# EAGLE schematic V3s_LX9_AD9957_gps (EAGLE 7.2.0)
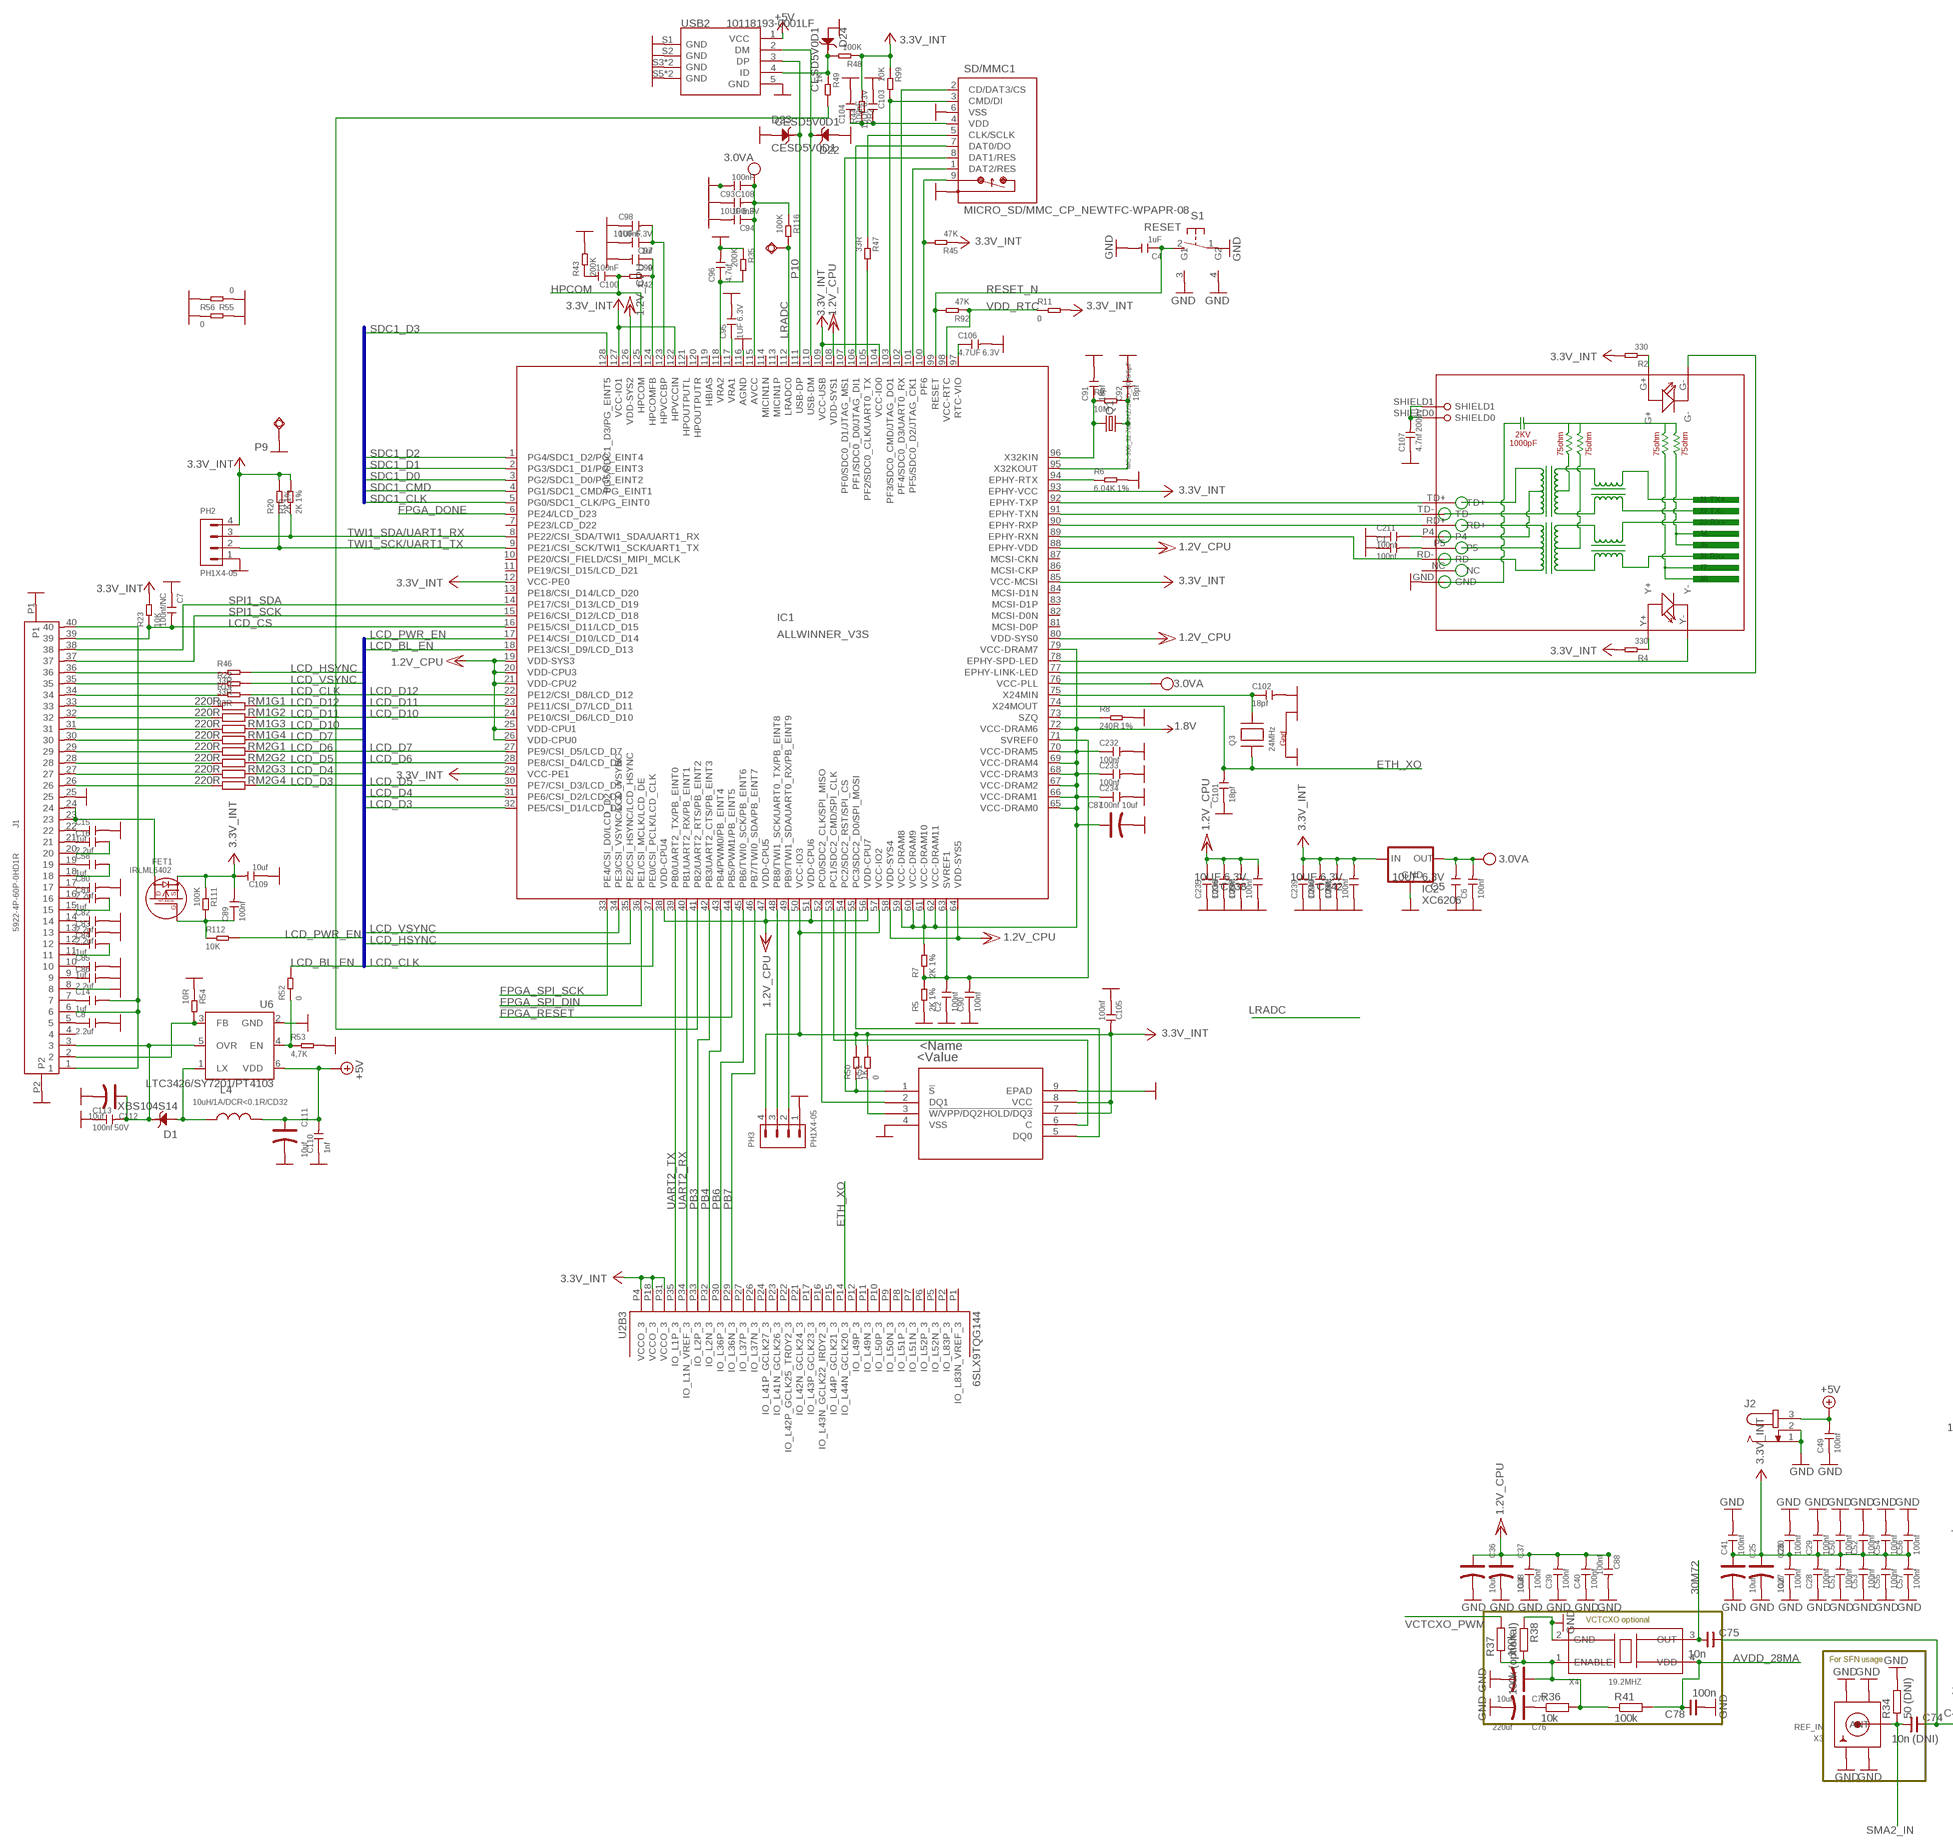
[diagram p0: schematic, sheet 1, part 1 of 3]
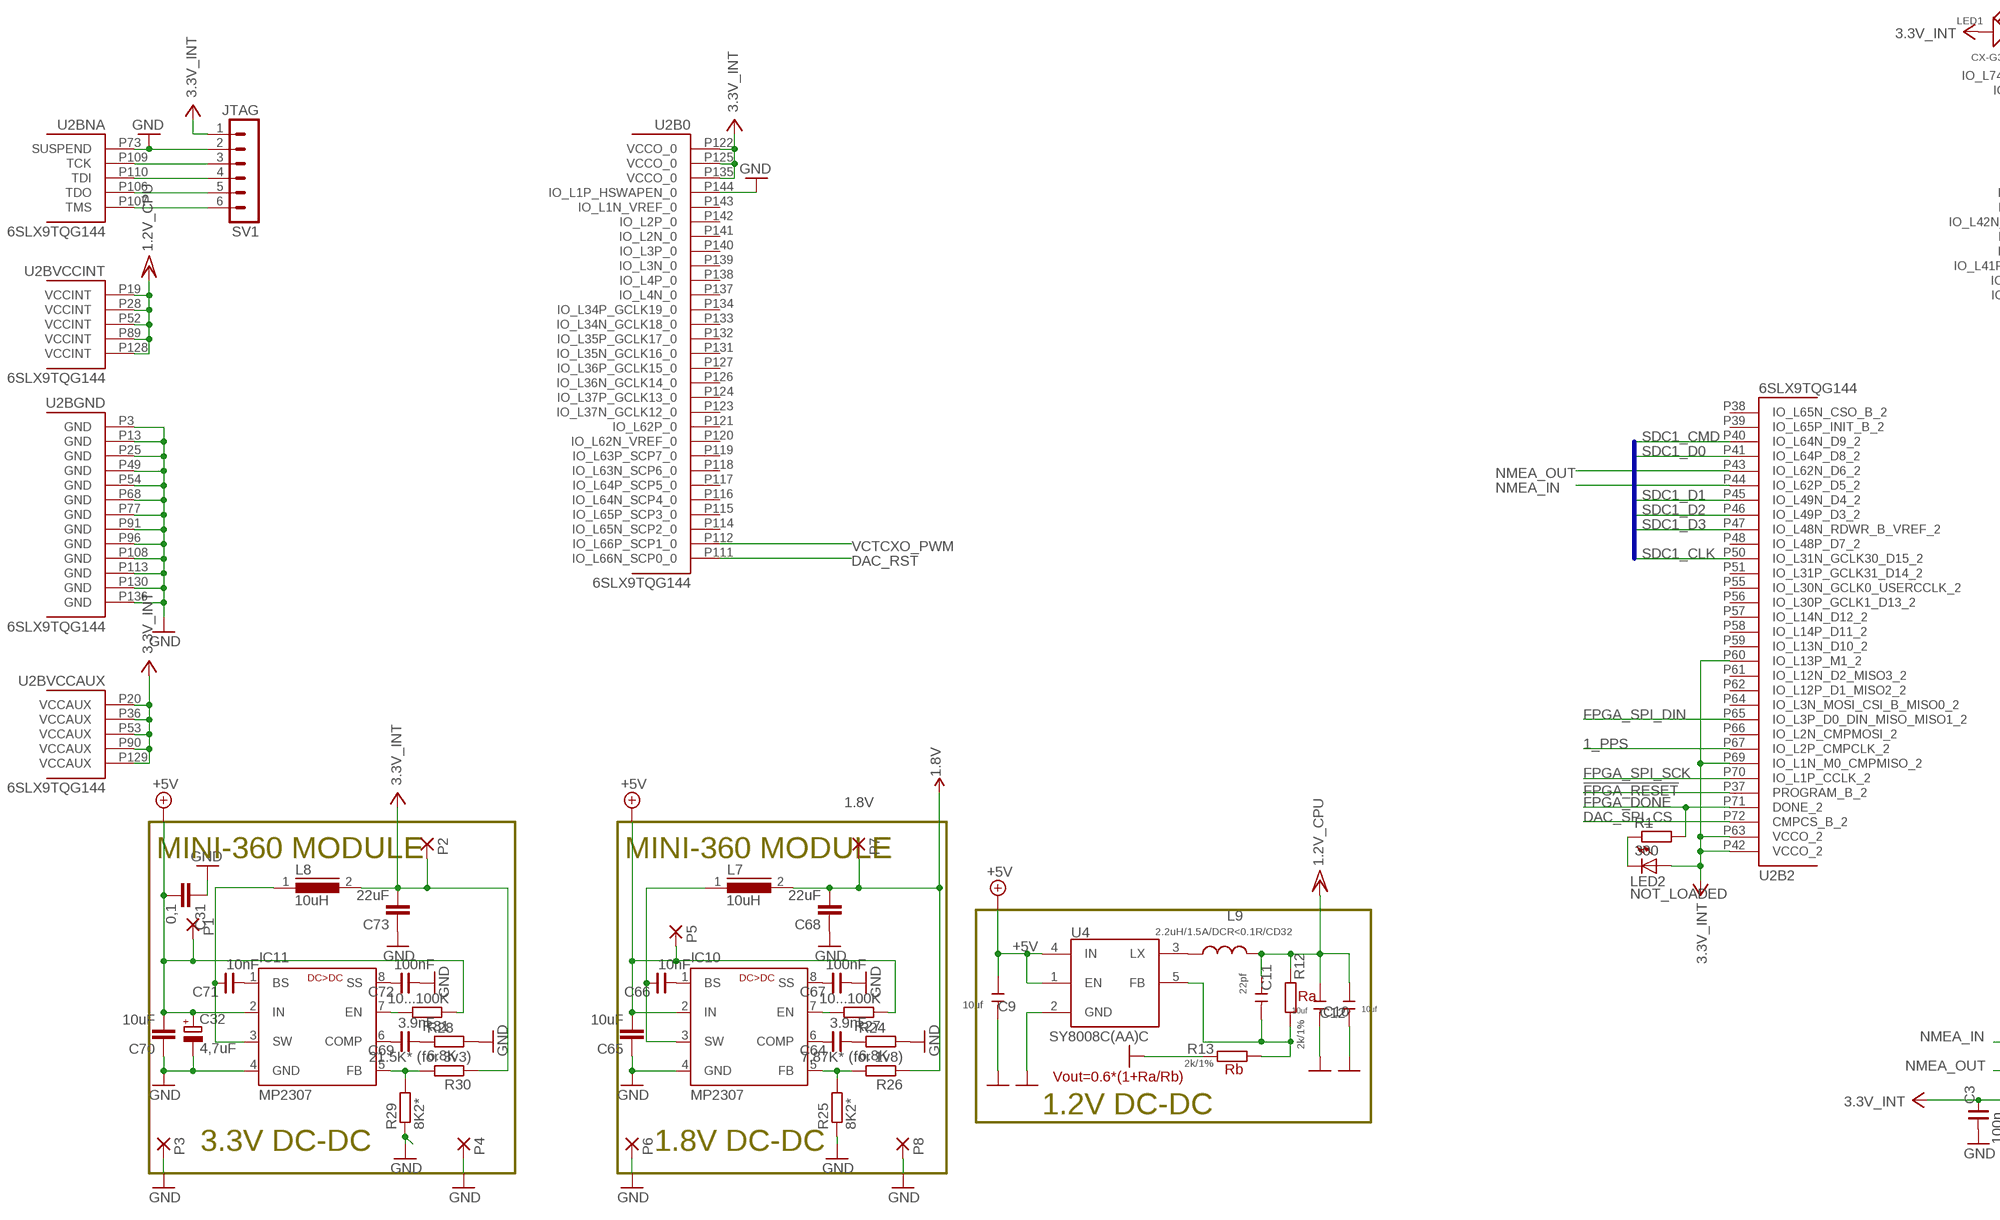
[diagram p1: schematic, sheet 1, part 2 of 3]
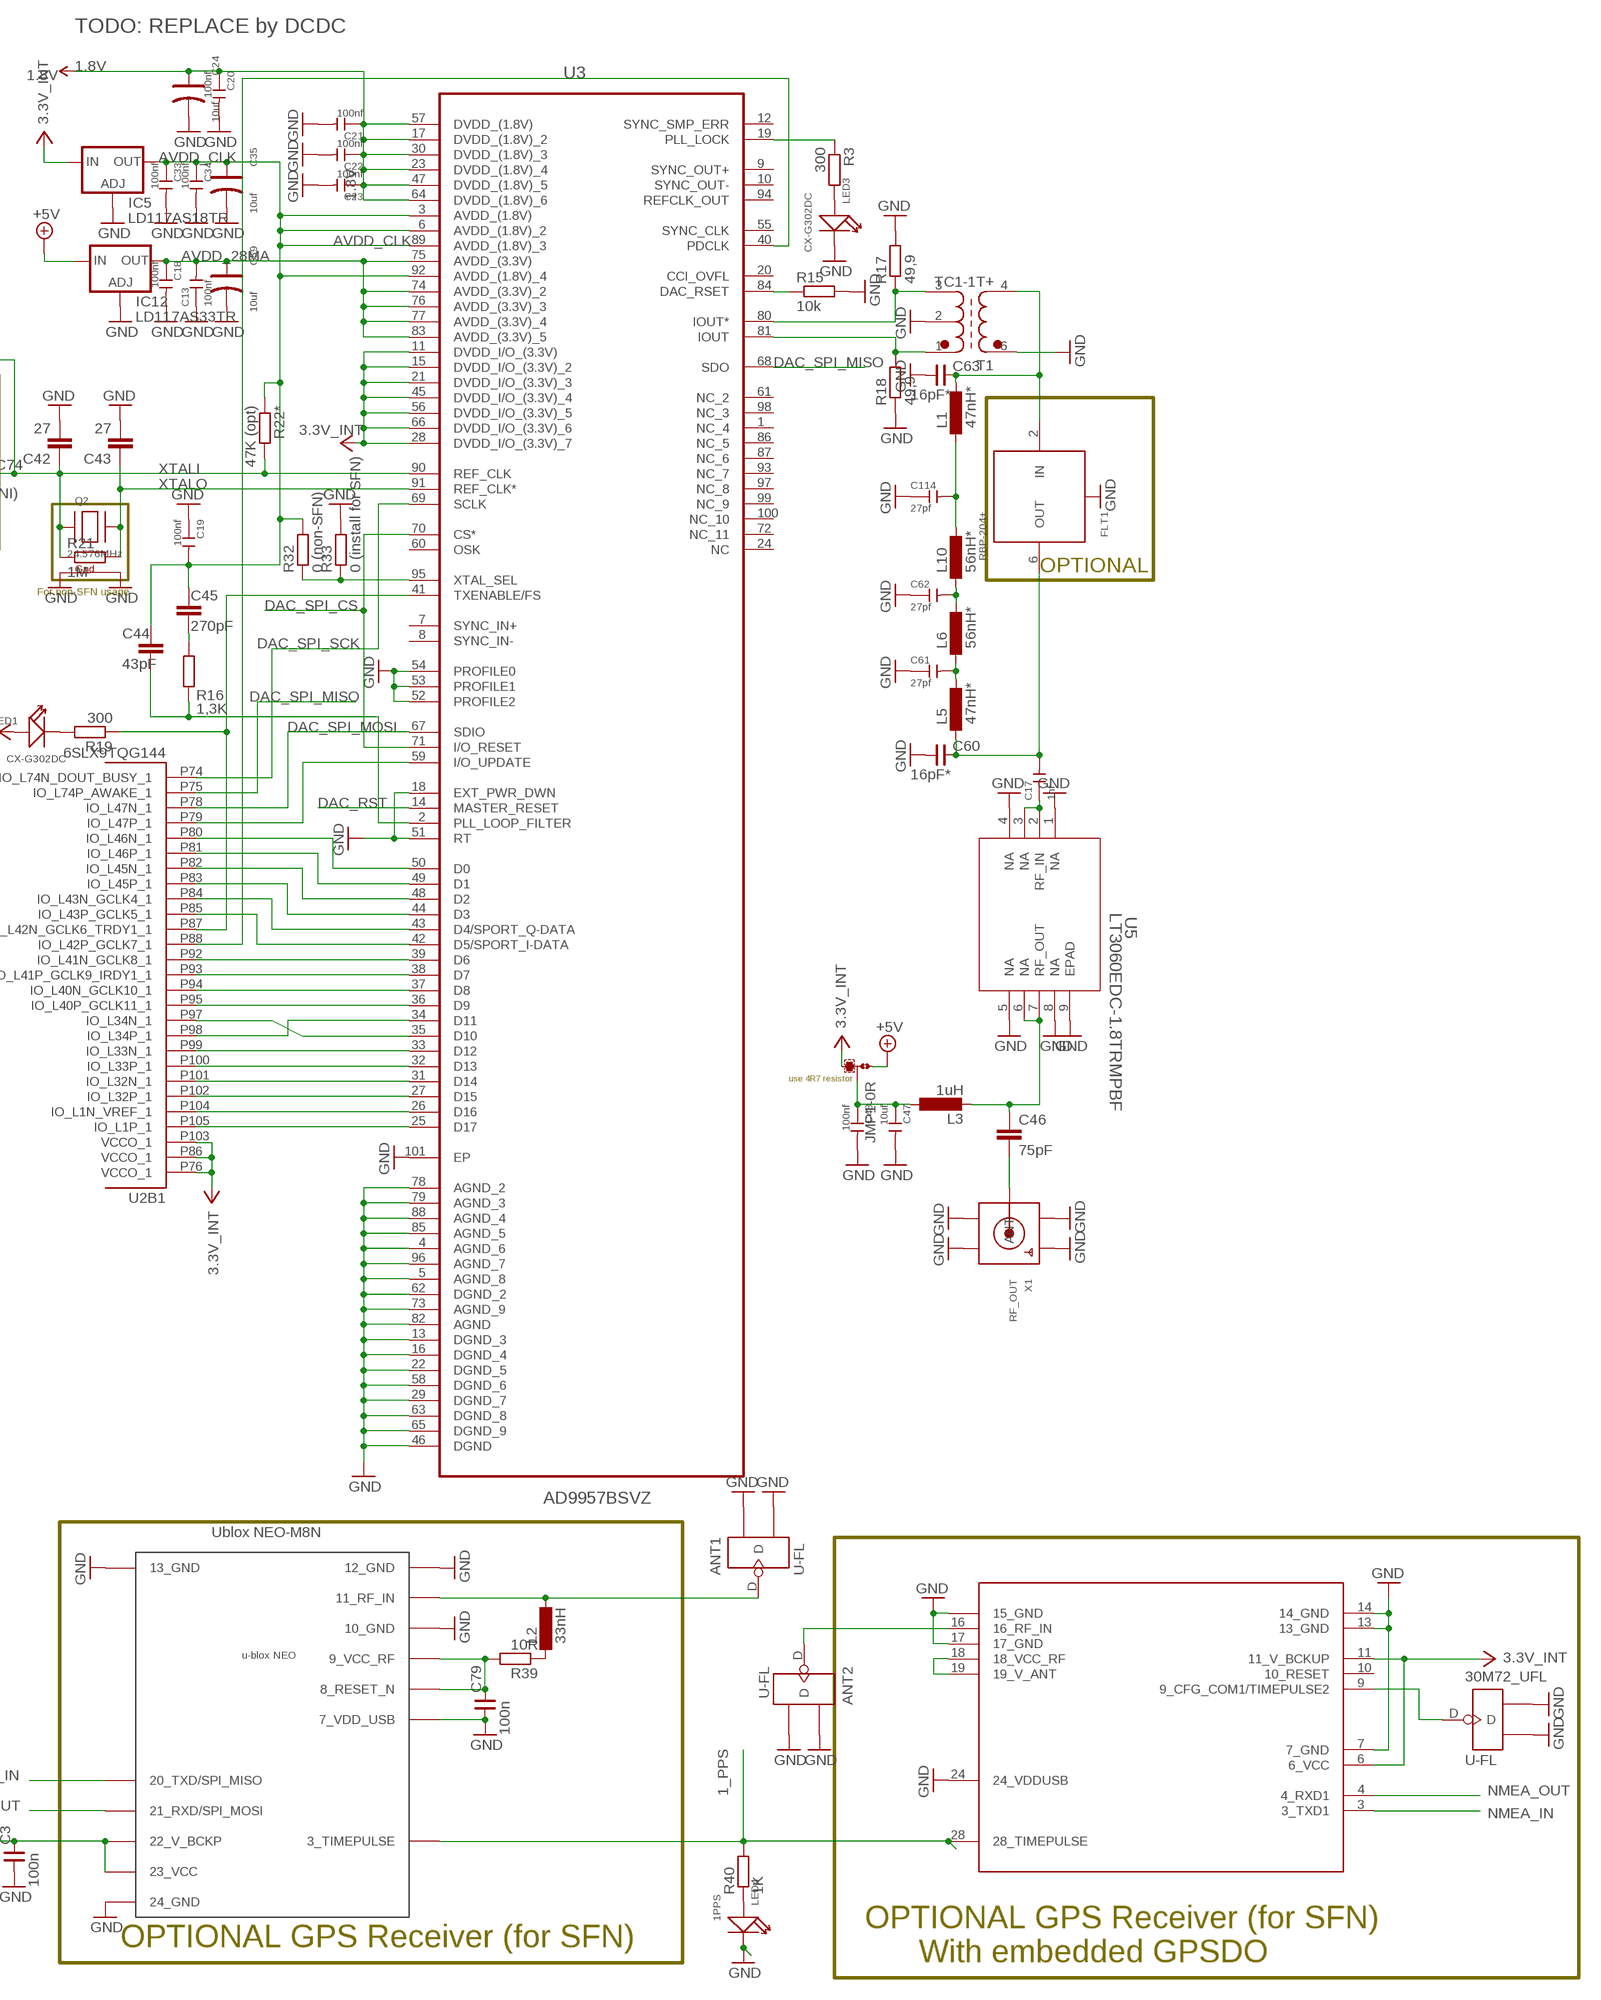
[diagram p2: schematic, sheet 1, part 3 of 3]

## Parts
30M72_UFL  U-FL  ANTENNA-CONN-U-FL(3P)  [U-FL3P-SMD-2.6X2.6X1.0MM]
ANT1  U-FL  ANTENNA-CONN-U-FL(3P)  [U-FL3P-SMD-2.6X2.6X1.0MM]
ANT2  U-FL  ANTENNA-CONN-U-FL(3P)  [U-FL3P-SMD-2.6X2.6X1.0MM]
C1  100nf  CERAMIC-100NF-50V-10%-X7R(0603)  [C0603]
C2  100nf  CERAMIC-100NF-50V-10%-X7R(0603)  [C0603]
C3  100n  CNP-0603  [0603]
C4  1uF  CERAMIC-100NF-50V-10%-X7R(0603)  [C0603]
C5  10UF 6.3V  CERAMIC-10UF-6.3V-20%-X5R(0603)  [C0603]
C6  100nf  CERAMIC-100NF-50V-10%-X7R(0603)  [C0603]
C7  100nf/NC  CERAMIC-100NF-50V-10%-X7R(0603)  [C0603]
C8  2.2uf  CERAMIC-2.2UF-10V-10%-X7R(0603)  [C0603]
C9  10uf  CERAMIC-10UF-10V-10%-X5R(0603)  [C0603]
C10  10uf  CERAMIC-10UF-10V-10%-X5R(0603)  [C0603]
C11  22pf  CERAMIC-22PF-50V-5%-NPO(0603)  [C0603]
C12  10uf  CERAMIC-10UF-10V-10%-X5R(0603)  [C0603]
C13  100nf  CERAMIC-100NF-50V-10%-X7R(0805)  [C0805]
C14  1uf  CERAMIC-1UF-25V-10%-X7R(0603)  [C0603]
C15  1uf  CERAMIC-1UF-25V-10%-X7R(0603)  [C0603]
C16  2.2uf  CERAMIC-2.2UF-10V-10%-X7R(0603)  [C0603]
C17  1nf  CERAMIC-1NF-50V-10%-X7R(0603)  [C0603]
C18  100nf  CERAMIC-100NF-50V-10%-X7R(0805)  [C0805]
C19  100nf  CERAMIC-100NF-50V-10%-X7R(0805)  [C0805]
C20  100nf  CERAMIC-100NF-50V-10%-X7R(0805)  [C0805]
C21  100nf  CERAMIC-100NF-50V-10%-X7R(0805)  [C0805]
C22  100nf  CERAMIC-100NF-50V-10%-X7R(0805)  [C0805]
C23  100nf  CERAMIC-100NF-50V-10%-X7R(0603)  [C0603]
C24  10uf  TANTALUM-SMD-10UF-10V-10%(AVX-A)  [AVX-A]
C25  10uf  TANTALUM-SMD-10UF-10V-10%(AVX-A)  [AVX-A]
C26  10uf  TANTALUM-SMD-10UF-10V-10%(AVX-A)  [AVX-A]
C27  100nf  CERAMIC-100NF-50V-10%-X7R(0805)  [C0805]
C28  100nf  CERAMIC-100NF-50V-10%-X7R(0805)  [C0805]
C29  100nf  CERAMIC-100NF-50V-10%-X7R(0805)  [C0805]
C30  100nf  CERAMIC-100NF-50V-10%-X7R(0603)  [C0603]
C31  0,1  C-EUC0805  [C0805]
C32  4,7uF  CPOL-EUA/3216-18R  [A/3216-18R]
C33  100nf  CERAMIC-100NF-50V-10%-X7R(0805)  [C0805]
C34  100nf  CERAMIC-100NF-50V-10%-X7R(0805)  [C0805]
C35  10uf  TANTALUM-SMD-10UF-10V-10%(AVX-A)  [AVX-A]
C36  10uf  TANTALUM-SMD-10UF-10V-10%(AVX-A)  [AVX-A]
C37  10uf  TANTALUM-SMD-10UF-10V-10%(AVX-A)  [AVX-A]
C38  100nf  CERAMIC-100NF-50V-10%-X7R(0603)  [C0603]
C39  100nf  CERAMIC-100NF-50V-10%-X7R(0603)  [C0603]
C40  100nf  CERAMIC-100NF-50V-10%-X7R(0603)  [C0603]
C41  100nf  CERAMIC-100NF-50V-10%-X7R(0805)  [C0805]
C42  27  C-EUC0805  [C0805]
C43  27  C-EUC0805  [C0805]
C44  43pF  C-EUC0805  [C0805]
C45  270pF  C-EUC0805  [C0805]
C46  75pF  C-EUC0805  [C0805]
C47  10uf  CERAMIC-10UF-25V-10%-X5R(0805)  [C0805]
C48  100nf  CERAMIC-100NF-50V-10%-X7R(0805)  [C0805]
C49  100nf  CERAMIC-100NF-50V-10%-X7R(0805)  [C0805]
C50  100nf  CERAMIC-100NF-50V-10%-X7R(0603)  [C0603]
C51  100nf  CERAMIC-100NF-50V-10%-X7R(0805)  [C0805]
C52  100nf  CERAMIC-100NF-50V-10%-X7R(0603)  [C0603]
C53  100nf  CERAMIC-100NF-50V-10%-X7R(0603)  [C0603]
C54  100nf  CERAMIC-100NF-50V-10%-X7R(0805)  [C0805]
C55  100nf  CERAMIC-100NF-50V-10%-X7R(0603)  [C0603]
C56  100nf  CERAMIC-100NF-50V-10%-X7R(0603)  [C0603]
C57  100nf  CERAMIC-100NF-50V-10%-X7R(0805)  [C0805]
C58  1uf  CERAMIC-1UF-25V-10%-X7R(0603)  [C0603]
C59  10uf  TANTALUM-SMD-10UF-10V-10%(AVX-A)  [AVX-A]
C60  16pF*  CNP-0603  [0603]
C61  27pf  CERAMIC-27PF-50V-5%-NPO(0603)  [C0603]
C62  27pf  CERAMIC-27PF-50V-5%-NPO(0603)  [C0603]
C63  16pF*  CNP-0603  [0603]
C64  3.9nF  CNP-0603  [0603]
C65  10uF  C-EUC1206  [C1206]
C66  10nF  CNP-0603  [0603]
C67  100nF  CNP-0603  [0603]
C68  22uF  C-EUC1206  [C1206]
C69  3.9nF  CNP-0603  [0603]
C70  10uF  C-EUC1206  [C1206]
C71  10nF  CNP-0603  [0603]
C72  100nF  CNP-0603  [0603]
C73  22uF  C-EUC1206  [C1206]
C74  10n (DNI)  CNP-0603  [0603]
C75  10n  CNP-0603  [0603]
C76  220uf  TANTALUM-SMD-470UF-6.3V(AVX-D)  [AVX-D]
C77  10uf  TANTALUM-SMD-10UF-10V-10%(AVX-A)  [AVX-A]
C78  100n  CNP-0603  [0603]
C79  100n  CNP-0603  [0603]
C80  2.2uf  CERAMIC-2.2UF-10V-10%-X7R(0603)  [C0603]
C81  1uf  CERAMIC-1UF-25V-10%-X7R(0603)  [C0603]
C82  2.2uf  CERAMIC-2.2UF-10V-10%-X7R(0603)  [C0603]
C83  2.2uf  CERAMIC-2.2UF-10V-10%-X7R(0603)  [C0603]
C84  1uf  CERAMIC-1UF-25V-10%-X7R(0603)  [C0603]
C85  1uf  CERAMIC-1UF-25V-10%-X7R(0603)  [C0603]
C86  2.2uf  CERAMIC-2.2UF-10V-10%-X7R(0603)  [C0603]
C87  10uf  TANTALUM-SMD-10UF-10V-10%(AVX-A)  [AVX-A]
C88  100nf  CERAMIC-100NF-50V-10%-X7R(0603)  [C0603]
C89  100nf  CERAMIC-100NF-50V-10%-X7R(0603)  [C0603]
C90  100nf  CERAMIC-100NF-50V-10%-X7R(0603)  [C0603]
C91  18pf  CERAMIC-100NF-50V-10%-X7R(0603)  [C0603]
C92  18pf  CERAMIC-100NF-50V-10%-X7R(0603)  [C0603]
C93  10UF 6.3V  CERAMIC-10UF-6.3V-20%-X5R(0603)  [C0603]
C94  100nF  CERAMIC-100NF-50V-10%-X7R(0603)  [C0603]
C95  1UF 6.3V  CERAMIC-10UF-6.3V-20%-X5R(0603)  [C0603]
C96  4.7uf  CERAMIC-4.7UF-10V-10%-X5R(0603)  [C0603]
C97  10UF 6.3V  CERAMIC-10UF-6.3V-20%-X5R(0603)  [C0603]
C98  100nF  CERAMIC-100NF-50V-10%-X7R(0603)  [C0603]
C99  1uf  CERAMIC-1UF-25V-10%-X7R(0603)  [C0603]
C100  100nF  CERAMIC-100NF-50V-10%-X7R(0603)  [C0603]
C101  18pf  CERAMIC-100NF-50V-10%-X7R(0603)  [C0603]
C102  18pf  CERAMIC-100NF-50V-10%-X7R(0603)  [C0603]
C103  10UF 6.3V  CERAMIC-10UF-6.3V-20%-X5R(0603)  [C0603]
C104  100nF  CERAMIC-100NF-50V-10%-X7R(0603)  [C0603]
C105  100nf  CERAMIC-100NF-50V-10%-X7R(0603)  [C0603]
C106  4.7UF 6.3V  CERAMIC-10UF-6.3V-20%-X5R(0603)  [C0603]
C107  4.7nf 2000V  CERAMIC-4.7UF-50V-10%-X5R(1206)  [C1206]
C108  100nF  CERAMIC-100NF-50V-10%-X7R(0603)  [C0603]
C109  10uf  CERAMIC-10UF-10V-(-20%～+80%)-Y5V(0805)  [C0805]
C110  1nf  CERAMIC-100NF-50V-10%-X7R(0603)  [C0603]
C111  10uf  TANTALUM-SMD-10UF-16V-10%(AVX-A)  [AVX-A]
C112  10uf  TANTALUM-SMD-10UF-10V-10%(AVX-A)  [AVX-A]
C113  100nf 50V  CERAMIC-100NF-50V-10%-X7R(0603)  [C0603]
C114  27pf  CERAMIC-27PF-50V-5%-NPO(0603)  [C0603]
C211  100nf  CERAMIC-100NF-50V-10%-X7R(0603)  [C0603]
C232  100nf  CERAMIC-100NF-50V-10%-X7R(0603)  [C0603]
C233  100nf  CERAMIC-100NF-50V-10%-X7R(0603)  [C0603]
C234  100nf  CERAMIC-100NF-50V-10%-X7R(0603)  [C0603]
C235  100nf  CERAMIC-100NF-50V-10%-X7R(0603)  [C0603]
C236  100nf  CERAMIC-100NF-50V-10%-X7R(0603)  [C0603]
C237  100nf  CERAMIC-100NF-50V-10%-X7R(0603)  [C0603]
C238  10UF 6.3V  CERAMIC-10UF-6.3V-20%-X5R(0603)  [C0603]
C239  100nf  CERAMIC-100NF-50V-10%-X7R(0603)  [C0603]
C240  100nf  CERAMIC-100NF-50V-10%-X7R(0603)  [C0603]
C241  100nf  CERAMIC-100NF-50V-10%-X7R(0603)  [C0603]
C242  10UF 6.3V  CERAMIC-10UF-6.3V-20%-X5R(0603)  [C0603]
D1  XBS104S14  SMD-DIODE-ESD-6.2V-250MW(SOD-123)  [SOD-123]
D22  CESD5V0D1  SMD-DIODE-ESD-6.2V-250MW(SOD-123)  [SOD-123]
D23  CESD5V0D1  SMD-DIODE-ESD-6.2V-250MW(SOD-123)  [SOD-123]
D24  CESD5V0D1  SMD-DIODE-ESD-6.2V-250MW(SOD-123)  [SOD-123]
FET1  IRLML6402  P-MOS+DIODIRLML6402  [SOT23]
FLT1  RBP-204+  RBP  [GP731]
IC1  ALLWINNER_V3S  [ELQFP128]
IC2  XC6206  XC63FPM  [SOT23]
IC5  LD117AS18TR  [SOT223]
IC10  MP2307  [SO8]
IC11  MP2307  [SO8]
IC12  LD117AS33TR  LD117AS18TR  [SOT223]
J1  5922-4P-60P-0HD1R  SMD-FPC-CONN(40P-0.5)  [FPCE40-SMD-0.5-90D]
J2  JACK-PLUG0  [SPC4077]
JMP1  0R-JUMPA  [A0R-JMP]
L1  47nH*  INDUCTOR_0603  [INDC1608X95N]
L2  33nH  INDUCTOR_0603  [INDC1608X95N]
L3  1uH  L-EUL3216C  [L3216C]
L4  10uH/1A/DCR<0.1R/CD32  L-CD32  [CD32]
L5  47nH*  INDUCTOR_0603  [INDC1608X95N]
L6  56nH*  INDUCTOR_0603  [INDC1608X95N]
L7  10uH  DR74  [DR74]
L8  10uH  DR74  [DR74]
L9  2.2uH/1.5A/DCR<0.1R/CD32  L-CD32  [CD32]
L10  56nH*  INDUCTOR_0603  [INDC1608X95N]
LED1  CX-G302DC  DIP-LED-GREEN-GREEN(2P-D3MM)  [LED2-2.54-D3.0MM]
LED2  NOT_LOADED  LEDCHIPLED_1206  [CHIPLED_1206]
LED3  CX-G302DC  DIP-LED-GREEN-GREEN(2P-D3MM)  [LED2-2.54-D3.0MM]
LED4  1PPS  DIP-LED-YELLOW-YELLOW-Y304DC(2P-D3MM)  [LED2-2.54-D3.0MM]
P1  1,6/0,8  [1,6/0,8]
P2  1,6/0,8  [1,6/0,8]
P3  1,6/0,8  [1,6/0,8]
P4  1,6/0,8  [1,6/0,8]
P5  1,6/0,8  [1,6/0,8]
P6  1,6/0,8  [1,6/0,8]
P7  1,6/0,8  [1,6/0,8]
P8  1,6/0,8  [1,6/0,8]
P9  TESTPADTESTPAD30/30  [TESTPAD_30-ROUND]
P10  TESTPADTESTPAD30/30  [TESTPAD_30-ROUND]
PH2  PH1X4-05  [PH005-1-4]
PH3  PH1X4-05  [PH005-1-4]
Q1  MC-306_32.768KHZ/SMD_8038/6pF  HC49/S_32768HZ/6PF  [MC-306]
Q2  24.576MHz  XTAL-4-3225  [NX3225]
Q3  24MHz  XTAL-4-3225  [NX3225]
R1  300  R-EU_M0805  [M0805]
R2  330  SMD-RES-6.8K-1%-1/10W(0603)  [R0603]
R3  300  R-EU_M0805  [M0805]
R4  330  SMD-RES-6.8K-1%-1/10W(0603)  [R0603]
R5  2K 1%  SMD-RES-6.8K-1%-1/10W(0603)  [R0603]
R6  6.04K 1%  SMD-RES-6.8K-1%-1/10W(0603)  [R0603]
R7  2K 1%  SMD-RES-6.8K-1%-1/10W(0603)  [R0603]
R8  240R 1%  SMD-RES-6.8K-1%-1/10W(0603)  [R0603]
R9  10M  SMD-RES-6.8K-1%-1/10W(0603)  [R0603]
R10  2K 1%  SMD-RES-6.8K-1%-1/10W(0603)  [R0603]
R11  0  SMD-RES-6.8K-1%-1/10W(0603)  [R0603]
R12  2k/1%  R-EU_R0603_5MIL_DWS  [R0603_5MIL_DWS]
R13  2k/1%  R-EU_R0603_5MIL_DWS  [R0603_5MIL_DWS]
R14  33R  SMD-RES-6.8K-1%-1/10W(0603)  [R0603]
R15  10k  R-EU_R0805  [R0805]
R16  1,3K  R-EU_R0805  [R0805]
R17  49,9  R-EU_R0805  [R0805]
R18  49,9  R-EU_R0805  [R0805]
R19  300  R-EU_M0805  [M0805]
R20  2K 1%  SMD-RES-6.8K-1%-1/10W(0603)  [R0603]
R21  1M  R-EU_R0805  [R0805]
R22  33R  SMD-RES-6.8K-1%-1/10W(0603)  [R0603]
R22*  47K (opt)  R-EU_R0603  [R0603]
R23  10K  SMD-RES-49.9R-1%-1/16W(0402)  [R0402]
R24  6.8K  R-EU_R0603  [R0603]
R25  8K2*  R-EU_R0603  [R0603]
R26  7.87K* (for 1v8)  R-EU_R0603  [R0603]
R27  10...100K  R-EU_R0603  [R0603]
R28  6.8K  R-EU_R0603  [R0603]
R29  8K2*  R-EU_R0603  [R0603]
R30  21.5K* (for 3v3)  R-EU_R0603  [R0603]
R31  10...100K  R-EU_R0603  [R0603]
R32  0 (non-SFN)  R-EU_R0402  [R0402]
R33  0 (install for SFN)  R-EU_R0402  [R0402]
R34  50 (DNI)  R-EU_R0402  [R0402]
R35  200K  SMD-RES-6.8K-1%-1/10W(0603)  [R0603]
R36  10k  R-EU_R0603  [R0603]
R37  100k  R-EU_R0603  [R0603]
R38  100k (optional)  R-EU_R0603  [R0603]
R39  10R  R-EU_R0402  [R0402]
R40  1K  R-EU_R0402  [R0402]
R41  100k  R-EU_R0603  [R0603]
R42  0  SMD-RES-6.8K-1%-1/10W(0603)  [R0603]
R43  200K  SMD-RES-6.8K-1%-1/10W(0603)  [R0603]
R44  2R2  SMD-RES-6.8K-1%-1/10W(0603)  [R0603]
R45  47K  SMD-RES-6.8K-1%-1/10W(0603)  [R0603]
R46  33R  SMD-RES-6.8K-1%-1/10W(0603)  [R0603]
R47  33R  SMD-RES-6.8K-1%-1/10W(0603)  [R0603]
R48  100K  SMD-RES-6.8K-1%-1/10W(0603)  [R0603]
R49  1K  SMD-RES-6.8K-1%-1/10W(0603)  [R0603]
R50  1K  SMD-RES-6.8K-1%-1/10W(0603)  [R0603]
R51  0  SMD-RES-6.8K-1%-1/10W(0603)  [R0603]
R52  0  SMD-RES-6.8K-1%-1/10W(0603)  [R0603]
R53  4,7K  SMD-RES-6.8K-1%-1/10W(0603)  [R0603]
R54  10R  SMD-RES-6.8K-1%-1/10W(0603)  [R0603]
R55  0  SMD-RES-6.8K-1%-1/10W(0603)  [R0603]
R56  0  SMD-RES-6.8K-1%-1/10W(0603)  [R0603]
R92  47K  SMD-RES-6.8K-1%-1/10W(0603)  [R0603]
R99  10K  SMD-RES-6.8K-1%-1/10W(0603)  [R0603]
R111  100K  SMD-RES-6.8K-1%-1/10W(0603)  [R0603]
R112  10K  SMD-RES-6.8K-1%-1/10W(0603)  [R0603]
R116  100K  SMD-RES-6.8K-1%-1/10W(0603)  [R0603]
RJ1  HR911105A  [HR911105A]
RM1  220R  R_MATRIX_4E_25X625  [R_MATRIX_4_0402_25X625]
RM2  220R  R_MATRIX_4E_25X625  [R_MATRIX_4_0402_25X625]
S1  RESET  31-XX  [B3F-31XX]
SD/MMC1  MICRO_SD/MMC_CP_NEWTFC-WPAPR-08  [TFC-WPAPR-08]
SV1  JTAG  MA06-1  [MA06-1]
T1  TC1-1T+  TC1-1TG2+  [AT224-3]
U1  N25Q256A13EF840EMIC  N25Q256A13EF840EMIC-VFDFPN-8_8X6-M  [MIC-VFDFPN-8_8X6-M]
U2  6SLX9TQG144  [TQ144]
U3  AD9957BSVZ  [QFP50P1600X1600X120-101N]
U4  SY8008C(AA)C  SY8008  [SOT23-5]
U5  LT3060EDC-1.8TRMPBF  [DFN-8_DC]
U6  LTC3426/SY7201/PT4103  SY7201  [SOT23-6]
U10  NEO-M8  [NEO-M8]
U11  UBLOX_LEA-6  [UBLOX_LEA-6T]
USB2  10118193-0001LF  MICRO-USB-SMD-B-(10118193-0001LF)  [MICRO-USB5+6P-SMD-0.65-B]
X1  RF_OUT  SMACONNECTOR  [SMA90_DIP]
X3  REF_IN  W5500_LX9_AD9957_SMACONNECTOR_EDGE_UFL  [W5500_LX9_AD9957_SMA_EDGELAUNCH_UFL]
X4  19.2MHZ  SMD-CRYSTAL-16MHZ-9PF-10PPM-60R(4P-3.2X2.5MM)  [X4-SMD-3.2X2.5X0.7MM]

## Nets
1.8V: C20.1 C21.1 C22.1 C23.1 C24.+ C68.2 C87.+ C232.1 C233.1 C234.1 IC1.59(VCC-DRAM8) IC1.60(VCC-DRAM9) IC1.61(VCC-DRAM10) IC1.62(VCC-DRAM11) IC1.65(VCC-DRAM0) IC1.66(VCC-DRAM1) IC1.67(VCC-DRAM2) IC1.68(VCC-DRAM3) IC1.69(VCC-DRAM4) IC1.70(VCC-DRAM5) IC1.72(VCC-DRAM6) IC1.79(VCC-DRAM7) L7.2 P7.1(P) R7.2 R26.1 U3.17(DVDD_(1.8V)_2) U3.23(DVDD_(1.8V)_4) U3.30(DVDD_(1.8V)_3) U3.47(DVDD_(1.8V)_5) U3.57(DVDD_(1.8V)) U3.64(DVDD_(1.8V)_6)
1_PPS: R40.2 U2.P67(B2:IO_L2P_CMPCLK_2) U10.3(3_TIMEPULSE) U11.28(28_TIMEPULSE)
30M72: C75.1 X4.3(OUT)
!FPGA_RESET: IC1.44(PB5/PWM1/PB_EINT5) U2.P37(B2:PROGRAM_B_2)
+5V: C9.1 C31.2 C32.+ C49.2 C65.2 C70.2 C110.2 C111.+ IC10.2(IN) IC11.2(IN) IC12.3(IN) J2.3 JMP1.1 L4.1 P1.1(P) P5.1(P) R27.1 R31.1 U4.1(EN) U4.4(IN) U6.6(VDD) USB2.1(VCC)
AVDD_28MA: C13.2 C18.1 C59.+ C78.2 IC12.4(OUT) R41.2 U3.74(AVDD_(3.3V)_2) U3.75(AVDD_(3.3V)) U3.76(AVDD_(3.3V)_3) U3.77(AVDD_(3.3V)_4) U3.83(AVDD_(3.3V)_5) X4.4(VDD)
AVDD_CLK: C19.2 C33.1 C34.1 C35.+ C44.1 C45.1 IC5.4(OUT) R22*.1 R32.2 U3.3(AVDD_(1.8V)) U3.6(AVDD_(1.8V)_2) U3.89(AVDD_(1.8V)_3) U3.92(AVDD_(1.8V)_4)
DAC_RST: U2.P111(B0:IO_L66N_SCP0_0) U3.14(MASTER_RESET)
DAC_SPI_CS: U2.P72(B2:CMPCS_B_2) U3.70(CS*) U3.71(I/O_RESET)
DAC_SPI_MISO: U2.P75(B1:IO_L74P_AWAKE_1) U3.68(SDO)
DAC_SPI_MOSI: U2.P78(B1:IO_L47N_1) U3.67(SDIO)
DAC_SPI_SCK: U2.P74(B1:IO_L74N_DOUT_BUSY_1) U3.69(SCLK)
ETH_XO: C101.2 IC1.74(X24MOUT) Q3.1(X1) U2.P14(B3:IO_L44N_GCLK20_3)
FPGA_DONE: IC1.6(PE24/LCD_D23) R1.2 U2.P71(B2:DONE_2)
FPGA_SPI_DIN: IC1.36(PE1/CSI_MCLK/LCD_DE) U2.P65(B2:IO_L3P_D0_DIN_MISO_MISO1_2)
FPGA_SPI_SCK: IC1.33(PE4/CSI_D0/LCD_D2) U2.P70(B2:IO_L1P_CCLK_2)
GND: 30M72_UFL.GND1 30M72_UFL.GND2 ANT1.GND1 ANT1.GND2 ANT2.GND1 ANT2.GND2 C1.1 C2.1 C3.1 C4.2 C5.1 C6.1 C7.1 C8.2 C9.2 C10.2 C12.2 C13.1 C15.2 C18.2 C19.1 C20.2 C21.2 C22.2 C23.2 C24.- C25.- C26.- C27.1 C28.1 C29.2 C30.2 C31.1 C32.- C33.2 C34.2 C35.- C36.- C37.- C38.1 C39.1 C40.1 C41.2 C42.2 C43.2 C47.2 C48.2 C49.1 C50.2 C51.1 C52.2 C53.1 C54.2 C55.1 C56.2 C57.1 C59.- C60.1 C61.1 C62.1 C63.1 C65.1 C67.1 C68.1 C70.1 C72.1 C73.1 C76.- C77.- C78.1 C79.1 C80.2 C82.2 C83.2 C85.2 C86.2 C87.- C88.2 C90.1 C91.2 C92.2 C93.1 C94.2 C95.2 C96.2 C97.2 C98.1 C99.2 C101.1 C102.2 C103.1 C104.2 C105.1 C106.2 C107.1 C108.2 C109.1 C110.1 C111.- C112.- C113.1 C114.1 C211.1 C232.2 C233.2 C234.2 C235.1 C236.1 C237.1 C238.1 C239.1 C240.1 C241.1 C242.1 D22.+ D23.+ D24.+ IC1.116(AGND) IC2.1(GND) IC5.1(ADJ) IC10.4(GND) IC11.4(GND) IC12.1(ADJ) J1.8 J1.25 J1.P1 J1.P2 J2.1 J2.2 LED3.K(-) LED4.K(-) P3.1(P) P4.1(P) P6.1(P) P8.1(P) P9.1(PP) PH2.1 PH3.1 Q2.2(G2) Q2.4(G1) Q3.2(G2) Q3.4(G1) R5.1 R6.2 R8.2 R13.2 R15.2 R17.2 R18.1 R24.2 R25.1 R28.2 R29.1 R33.2 R34.2 R35.1 R38.1 R43.2 R53.2 R54.1 R55.1 R55.2 R56.1 R56.2 RJ1.GND S1.1(P) S1.3(G1) S1.4(G2) SD/MMC1.6(VSS) SD/MMC1.10(PACK1) SV1.2 T1.2(SCT) T1.6(PD) U1.4(VSS) U1.9(EPAD) U2.P3(BGND:GND) U2.P13(BGND:GND) U2.P25(BGND:GND) U2.P49(BGND:GND) U2.P54(BGND:GND) U2.P68(BGND:GND) U2.P73(BNA:SUSPEND) U2.P77(BGND:GND) U2.P91(BGND:GND) U2.P96(BGND:GND) U2.P108(BGND:GND) U2.P113(BGND:GND) U2.P130(BGND:GND) U2.P136(BGND:GND) U2.P144(B0:IO_L1P_HSWAPEN_0) U3.4(AGND_6) U3.5(AGND_8) U3.13(DGND_3) U3.16(DGND_4) U3.18(EXT_PWR_DWN) U3.22(DGND_5) U3.29(DGND_7) U3.46(DGND) U3.51(RT) U3.52(PROFILE2) U3.53(PROFILE1) U3.54(PROFILE0) U3.58(DGND_6) U3.62(DGND_2) U3.63(DGND_8) U3.65(DGND_9) U3.73(AGND_9) U3.78(AGND_2) U3.79(AGND_3) U3.82(AGND) U3.85(AGND_5) U3.88(AGND_4) U3.96(AGND_7) U3.101(EP) U4.2(GND) U5.1(NA) U5.4(NA) U5.5(NA) U5.8(NA) U5.9(EPAD) U6.2(GND) U10.7(7_VDD_USB) U10.10(10_GND) U10.12(12_GND) U10.13(13_GND) U10.24(24_GND) U11.7(7_GND) U11.13(13_GND) U11.14(14_GND) U11.15(15_GND) U11.17(17_GND) U11.24(24_VDDUSB) USB2.5(GND) USB2.S1(GND) USB2.S2(GND) USB2.S3(GND) USB2.S4(GND) USB2.S5(GND) USB2.S6(GND) X1.GND1 X1.GND2 X1.GND3 X1.GND4 X3.GND@1(GND1) X3.GND@2(GND2) X3.GND@3(GND3) X3.GND@4(GND4) X4.2(GND)
GPSDO_OUT_30M72: 30M72_UFL.D U11.9(9_CFG_COM1/TIMEPULSE2)
HPCOM: C100.1 IC1.125(HPCOM) R42.2
LCD_BL_EN: IC1.18(PE13/CSI_D9/LCD_D13) R52.2
LCD_CLK: IC1.37(PE0/CSI_PCLK/LCD_CLK) R14.2
LCD_CS: C7.2 IC1.16(PE15/CSI_D11/LCD_D15) J1.39 R23.1
LCD_D3: IC1.32(PE5/CSI_D1/LCD_D3) RM2.4.1
LCD_D4: IC1.31(PE6/CSI_D2/LCD_D4) RM2.3.1
LCD_D5: IC1.30(PE7/CSI_D3/LCD_D5) RM2.2.1
LCD_D6: IC1.28(PE8/CSI_D4/LCD_D6) RM2.1.1
LCD_D7: IC1.27(PE9/CSI_D5/LCD_D7) RM1.4.1
LCD_D10: IC1.24(PE10/CSI_D6/LCD_D10) RM1.3.1
LCD_D11: IC1.23(PE11/CSI_D7/LCD_D11) RM1.2.1
LCD_D12: IC1.22(PE12/CSI_D8/LCD_D12) RM1.1.1
LCD_HSYNC: IC1.35(PE2/CSI_HSYNC/LCD_HSYNC) R46.2
LCD_PWR_EN: IC1.17(PE14/CSI_D10/LCD_D14) R112.2
LCD_VSYNC: IC1.34(PE3/CSI_VSYNC/LCD_VSYNC) R22.2
LRADC: IC1.112(LRADC0) P10.1(PP) R116.2
N$1: SV1.6 U2.P107(BNA:TMS)
N$2: SV1.5 U2.P106(BNA:TDO)
N$3: SV1.4 U2.P110(BNA:TDI)
N$4: SV1.3 U2.P109(BNA:TCK)
N$5: LED2.C R1.1
N$6: C62.2 L6.2 L10.1
N$7: U2.P105(B1:IO_L1P_1) U3.25(D17)
N$8: C14.2 J1.1 J1.6 J1.40
N$9: U2.P88(B1:IO_L42P_GCLK7_1) U3.40(PDCLK)
N$10: R19.1 U2.P87(B1:IO_L42N_GCLK6_TRDY1_1) U3.41(TXENABLE/FS)
N$11: U2.P85(B1:IO_L43P_GCLK5_1) U3.42(D5/SPORT_I-DATA)
N$12: U2.P84(B1:IO_L43N_GCLK4_1) U3.43(D4/SPORT_Q-DATA)
N$13: U2.P83(B1:IO_L45P_1) U3.44(D3)
N$14: U2.P82(B1:IO_L45N_1) U3.48(D2)
N$15: U2.P92(B1:IO_L41N_GCLK8_1) U3.39(D6)
N$16: U2.P93(B1:IO_L41P_GCLK9_IRDY1_1) U3.38(D7)
N$17: U2.P94(B1:IO_L40N_GCLK10_1) U3.37(D8)
N$18: U2.P95(B1:IO_L40P_GCLK11_1) U3.36(D9)
N$19: U2.P98(B1:IO_L34P_1) U3.34(D11)
N$20: U2.P97(B1:IO_L34N_1) U3.35(D10)
N$21: U2.P99(B1:IO_L33N_1) U3.33(D12)
N$22: U2.P100(B1:IO_L33P_1) U3.32(D13)
N$23: U2.P101(B1:IO_L32N_1) U3.31(D14)
N$24: U2.P102(B1:IO_L32P_1) U3.27(D15)
N$25: U2.P104(B1:IO_L1N_VREF_1) U3.26(D16)
N$26: U2.P79(B1:IO_L47P_1) U3.59(I/O_UPDATE)
N$27: C14.1 J1.7
N$28: U2.P81(B1:IO_L46P_1) U3.49(D1)
N$29: LED3.A(+) R3.2
N$30: R3.1 U3.19(PLL_LOCK)
N$31: R15.1 U3.84(DAC_RSET)
N$32: R17.1 T1.3(S) U3.80(IOUT*)
N$33: R18.2 T1.1(SD) U3.81(IOUT)
N$34: C63.2 FLT1.2(IN) L1.2 T1.4(P)
N$35: U2.P80(B1:IO_L46N_1) U3.50(D0)
N$36: IC1.89(EPHY-RXN) RJ1.RD-
N$37: C211.2 RJ1.P4
N$38: IC1.94(EPHY-RTX) R6.1
N$39: IC1.78(EPHY-SPD-LED) RJ1.Y-
N$40: IC1.77(EPHY-LINK-LED) RJ1.G-
N$41: R4.1 RJ1.Y+
N$42: R2.1 RJ1.G+
N$43: C2.2 C90.2 IC1.63(SVREF1) IC1.71(SVREF0) R5.2 R7.1
N$44: IC1.73(SZQ) R8.1
N$45: C92.1 IC1.95(X32KOUT) Q1.1 R9.2
N$46: C91.1 IC1.96(X32KIN) Q1.4 R9.1
N$47: D22.- IC1.110(USB-DM) USB2.2(DM)
N$48: D23.- IC1.111(USB-DP) USB2.3(DP)
N$49: C95.1 IC1.117(VRA1)
N$50: C96.1 IC1.118(VRA2) R35.2
N$51: C99.1 IC1.124(HPCOMFB) R42.1
N$52: C102.1 IC1.75(X24MIN) Q3.3(X2)
N$53: U11.18(18_VCC_RF) U11.19(19_V_ANT)
N$54: IC1.107(PF0/SDC0_D1/JTAG_MS1) SD/MMC1.8(DAT1/RES)
N$55: IC1.106(PF1/SDC0_D0/JTAG_DI1) SD/MMC1.7(DAT0/DO)
N$56: R47.1 SD/MMC1.5(CLK/SCLK)
N$57: IC1.103(PF3/SDC0_CMD/JTAG_DO1) R99.2 SD/MMC1.3(CMD/DI)
N$58: IC1.102(PF4/SDC0_D3/UART0_RX) SD/MMC1.2(CD/DAT3/CS)
N$59: IC1.101(PF5/SDC0_D2/JTAG_CK1) SD/MMC1.1(DAT2/RES)
N$60: IC1.100(PF6) R45.2 SD/MMC1.9(CP_E)
N$61: ANT1.D L2.2 U10.11(11_RF_IN)
N$62: IC1.105(PF2/SDC0_CLK/UART0_TX) R47.2
N$63: D24.- R48.2 R49.1 USB2.4(ID)
N$64: IC1.41(PB2/UART2_RTS/PB_EINT2) R49.2
N$65: IC1.92(EPHY-TXP) RJ1.TD+
N$66: IC1.91(EPHY-TXN) RJ1.TD-
N$67: IC1.90(EPHY-RXP) RJ1.RD+
N$68: L9.1 U4.3(LX)
N$69: C97.1 C98.2 IC1.123(HPVCCBP)
N$70: C8.1 J1.5
N$71: R51.1 U1.3(!W/VPP/DQ2)
N$72: C11.2 R12.2 R13.1 U4.5(FB)
N$73: J1.33 RM1.1.2
N$74: ANT2.D U11.16(16_RF_IN)
N$75: C114.2 L1.1 L10.2
N$77: C44.2 R16.2 U3.2(PLL_LOOP_FILTER)
N$78: J1.36 R46.1
N$79: J1.35 R22.1
N$80: J1.34 R14.1
N$81: J1.32 RM1.2.2
N$82: J1.31 RM1.3.2
N$83: J1.30 RM1.4.2
N$84: C45.2 R16.1
N$85: C17.2 C60.2 FLT1.6(OUT) L5.1
N$86: J1.29 RM2.1.2
N$87: C46.1 L3.2 U5.6(NA) U5.7(RF_OUT)
N$88: C46.2 X1.ANTENNA(ANT)
N$89: C47.1 C48.1 JMP1.2 L3.1
N$90: LED1.K(-) R19.2
N$91: L2.1 R39.1
N$92: C61.2 L5.2 L6.1
N$93: J1.28 RM2.2.2
N$94: C79.2 R39.2 U10.8(8_RESET_N) U10.9(9_VCC_RF)
N$95: LED4.A(+) R40.1
N$96: J1.27 RM2.3.2
N$97: J1.26 RM2.4.2
N$100: C15.1 J1.22
N$103: C17.1 U5.2(RF_IN) U5.3(NA)
N$104: C64.2 IC10.6(COMP)
N$105: C64.1 R24.1
N$106: C66.1 IC10.1(BS)
N$107: C66.2 IC10.3(SW) L7.1
N$108: C67.2 IC10.8(SS)
N$109: IC10.5(FB) R25.2 R26.2
N$110: R32.1 R33.1 U3.95(XTAL_SEL)
N$111: IC10.7(EN) R27.2
N$112: C100.2 R43.1
N$113: C69.1 R28.1
N$114: C69.2 IC11.6(COMP)
N$115: C71.1 IC11.1(BS)
N$116: C71.2 IC11.3(SW) L8.1
N$117: C72.2 IC11.8(SS)
N$118: IC11.5(FB) R29.2 R30.2
N$119: C103.2 C104.1 R44.1 SD/MMC1.4(VDD)
N$120: IC11.7(EN) R31.2
N$121: C76.+ R36.1
N$122: C77.+ R36.2 R37.1 R38.2 R41.1 X4.1(ENABLE)
N$123: C16.1 J1.21
N$124: C16.2 J1.20
N$125: C58.1 J1.19
N$126: C58.2 J1.18
N$127: C80.1 J1.17
N$128: C81.1 J1.16
N$129: C81.2 J1.15
N$130: C82.1 J1.14
N$131: C83.1 J1.13
N$132: C84.1 J1.12
N$133: C84.2 J1.11
N$134: C85.1 J1.10
N$135: C86.1 J1.9
N$136: R52.1 R53.1 U6.4(EN)
N$137: D1.+ L4.2 U6.1(LX)
N$138: J1.2 R54.2 U6.3(FB)
N$139: C112.+ C113.2 D1.- J1.3 U6.5(OVR)
N$221: IC1.48(PB8/TWI1_SCK/UART0_TX/PB_EINT8) PH3.3
N$222: IC1.49(PB9/TWI1_SDA/UART0_RX/PB_EINT9) PH3.2
N$223: IC1.54(PC2/SDC2_RST/SPI_CS) R50.1 U1.1(!S)
N$224: IC1.52(PC0/SDC2_CLK/SPI_MISO) U1.2(DQ1)
N$226: IC1.53(PC1/SDC2_CMD/SPI_CLK) U1.6(C)
N$228: IC1.55(PC3/SDC2_D0/SPI_MOSI) U1.5(DQ0)
N$240: C106.1 IC1.97(RTC-VIO)
N$241: C107.2 RJ1.SHIELD0 RJ1.SHIELD1
N$258: FET1.3(D) J1.23 J1.24
N$266: C89.1 FET1.1(G) R111.2 R112.1
N$282: C1.2 RJ1.P5
NMEA_IN: U2.P44(B2:IO_L62P_D5_2) U10.20(20_TXD/SPI_MISO) U11.3(3_TXD1)
NMEA_OUT: U2.P43(B2:IO_L62N_D6_2) U10.21(21_RXD/SPI_MOSI) U11.4(4_RXD1)
PB3: IC1.42(PB3/UART2_CTS/PB_EINT3) U2.P33(B3:IO_L2P_3)
PB4: IC1.43(PB4/PWM0/PB_EINT4) U2.P32(B3:IO_L2N_3)
PB6: IC1.45(PB6/TWI0_SCK/PB_EINT6) U2.P30(B3:IO_L36P_3)
PB7: IC1.46(PB7/TWI0_SDA/PB_EINT7) U2.P29(B3:IO_L36N_3)
RESET_N: C4.1 IC1.99(RESET) R92.2 S1.2(S)
SDC1_CLK: IC1.5(PG0/SDC1_CLK/PG_EINT0) U2.P50(B2:IO_L31N_GCLK30_D15_2)
SDC1_CMD: IC1.4(PG1/SDC1_CMD/PG_EINT1) U2.P40(B2:IO_L64N_D9_2)
SDC1_D0: IC1.3(PG2/SDC1_D0/PG_EINT2) U2.P41(B2:IO_L64P_D8_2)
SDC1_D1: IC1.2(PG3/SDC1_D1/PG_EINT3) U2.P45(B2:IO_L49N_D4_2)
SDC1_D2: IC1.1(PG4/SDC1_D2/PG_EINT4) U2.P46(B2:IO_L49P_D3_2)
SDC1_D3: IC1.128(PG5/SDC1_D3/PG_EINT5) U2.P47(B2:IO_L48N_RDWR_B_VREF_2)
SMA2_IN: C74.1 R34.1 X3.P(ANT)
SPI1_SCK: IC1.15(PE16/CSI_D12/LCD_D18) J1.37
SPI1_SDA: IC1.14(PE17/CSI_D13/LCD_D19) J1.38
TWI1_SCK/UART1_TX: IC1.9(PE21/CSI_SCK/TWI1_SCK/UART1_TX) PH2.2 R20.1
TWI1_SDA/UART1_RX: IC1.8(PE22/CSI_SDA/TWI1_SDA/UART1_RX) PH2.3 R10.1
UART2_RX: IC1.40(PB1/UART2_RX/PB_EINT1) U2.P34(B3:IO_L1N_VREF_3)
UART2_TX: IC1.39(PB0/UART2_TX/PB_EINT0) U2.P35(B3:IO_L1P_3)
VCC/2: C10.1 C11.1 C12.1 C36.+ C37.+ C38.2 C39.2 C40.2 C88.1 C235.2 C236.2 C237.2 C238.2 IC1.19(VDD-SYS3) IC1.20(VDD-CPU3) IC1.21(VDD-CPU2) IC1.25(VDD-CPU1) IC1.26(VDD-CPU0) IC1.38(VDD-CPU4) IC1.47(VDD-CPU5) IC1.51(VDD-CPU6) IC1.56(VDD-CPU7) IC1.58(VDD-SYS4) IC1.64(VDD-SYS5) IC1.80(VDD-SYS0) IC1.88(EPHY-VDD) IC1.108(VDD-SYS1) IC1.126(VDD-SYS2) L9.2 R12.1 U2.P19(BVCCINT:VCCINT) U2.P28(BVCCINT:VCCINT) U2.P52(BVCCINT:VCCINT) U2.P89(BVCCINT:VCCINT) U2.P128(BVCCINT:VCCINT) ; supply symbol labelled 1.2V_CPU
VCCINT: C3.2 C25.+ C26.+ C27.2 C28.2 C29.1 C30.1 C41.1 C50.1 C51.2 C52.1 C53.2 C54.1 C55.2 C56.1 C57.2 C73.2 C89.2 C105.2 C109.2 C239.2 C240.2 C241.2 C242.2 FET1.2(S) IC1.12(VCC-PE0) IC1.29(VCC-PE1) IC1.50(VCC-IO3) IC1.57(VCC-IO2) IC1.85(VCC-MCSI) IC1.93(EPHY-VCC) IC1.104(VCC-IO0) IC1.109(VCC-USB) IC1.122(HPVCCIN) IC1.127(VCC-IO1) IC2.3(IN) IC5.3(IN) JMP1.3 L8.2 LED1.A(+) LED2.A P2.1(P) PH2.4 PH3.4 R2.2 R4.2 R10.2 R11.2 R20.2 R23.2 R30.1 R44.2 R45.1 R48.1 R50.2 R51.2 R99.1 R111.1 SV1.1 U1.7(!HOLD/DQ3) U1.8(VCC) U2.P4(B3:VCCO_3) U2.P18(B3:VCCO_3) U2.P20(BVCCAUX:VCCAUX) U2.P31(B3:VCCO_3) U2.P36(BVCCAUX:VCCAUX) U2.P42(B2:VCCO_2) U2.P53(BVCCAUX:VCCAUX) U2.P60(B2:IO_L13P_M1_2) U2.P63(B2:VCCO_2) U2.P69(B2:IO_L1N_M0_CMPMISO_2) U2.P76(B1:VCCO_1) U2.P86(B1:VCCO_1) U2.P90(BVCCAUX:VCCAUX) U2.P103(B1:VCCO_1) U2.P122(B0:VCCO_0) U2.P125(B0:VCCO_0) U2.P129(BVCCAUX:VCCAUX) U2.P135(B0:VCCO_0) U3.11(DVDD_I/O_(3.3V)) U3.15(DVDD_I/O_(3.3V)_2) U3.21(DVDD_I/O_(3.3V)_3) U3.28(DVDD_I/O_(3.3V)_7) U3.45(DVDD_I/O_(3.3V)_4) U3.56(DVDD_I/O_(3.3V)_5) U3.66(DVDD_I/O_(3.3V)_6) U10.22(22_V_BCKP) U10.23(23_VCC) U11.6(6_VCC) U11.11(11_V_BCKUP) ; supply symbol labelled 3.3V_INT
VCTCXO_PWM: R37.2 U2.P112(B0:IO_L66P_SCP1_0)
VDD_RTC: IC1.98(VCC-RTC) R11.1 R92.1
VPP [pwr]: C5.2 C6.2 C93.2 C94.1 C108.1 IC1.76(VCC-PLL) IC1.115(AVCC) IC2.2(OUT) R116.1 ; supply symbol labelled 3.0VA
XTALI: C42.1 C74.2 C75.2 Q2.1(X1) R21.1 R22*.2 U3.90(REF_CLK)
XTALO: C43.1 Q2.3(X2) R21.2 U3.91(REF_CLK*)
Unconnected: IC1.7(PE23/LCD_D22) IC1.10(PE20/CSI_FIELD/CSI_MIPI_MCLK) IC1.11(PE19/CSI_D15/LCD_D21) IC1.13(PE18/CSI_D14/LCD_D20) IC1.81(MCSI-D0P) IC1.82(MCSI-D0N) IC1.83(MCSI-D1P) IC1.84(MCSI-D1N) IC1.86(MCSI-CKP) IC1.87(MCSI-CKN) IC1.113(MICIN1P) IC1.114(MICIN1N) IC1.119(HBIAS) IC1.120(HPOUTPUTR) IC1.121(HPOUTPUTL) J1.4 RJ1.NC U2.P1(B3:IO_L83N_VREF_3) U2.P2(B3:IO_L83P_3) U2.P5(B3:IO_L52N_3) U2.P6(B3:IO_L52P_3) U2.P7(B3:IO_L51N_3) U2.P8(B3:IO_L51P_3) U2.P9(B3:IO_L50N_3) U2.P10(B3:IO_L50P_3) U2.P11(B3:IO_L49N_3) U2.P12(B3:IO_L49P_3) U2.P15(B3:IO_L44P_GCLK21_3) U2.P16(B3:IO_L43N_GCLK22_IRDY2_3) U2.P17(B3:IO_L43P_GCLK23_3) U2.P21(B3:IO_L42N_GCLK24_3) U2.P22(B3:IO_L42P_GCLK25_TRDY2_3) U2.P23(B3:IO_L41N_GCLK26_3) U2.P24(B3:IO_L41P_GCLK27_3) U2.P26(B3:IO_L37N_3) U2.P27(B3:IO_L37P_3) U2.P38(B2:IO_L65N_CSO_B_2) U2.P39(B2:IO_L65P_INIT_B_2) U2.P48(B2:IO_L48P_D7_2) U2.P51(B2:IO_L31P_GCLK31_D14_2) U2.P55(B2:IO_L30N_GCLK0_USERCCLK_2) U2.P56(B2:IO_L30P_GCLK1_D13_2) U2.P57(B2:IO_L14N_D12_2) U2.P58(B2:IO_L14P_D11_2) U2.P59(B2:IO_L13N_D10_2) U2.P61(B2:IO_L12N_D2_MISO3_2) U2.P62(B2:IO_L12P_D1_MISO2_2) U2.P64(B2:IO_L3N_MOSI_CSI_B_MISO0_2) U2.P66(B2:IO_L2N_CMPMOSI_2) U2.P114(B0:IO_L65N_SCP2_0) U2.P115(B0:IO_L65P_SCP3_0) U2.P116(B0:IO_L64N_SCP4_0) U2.P117(B0:IO_L64P_SCP5_0) U2.P118(B0:IO_L63N_SCP6_0) U2.P119(B0:IO_L63P_SCP7_0) U2.P120(B0:IO_L62N_VREF_0) U2.P121(B0:IO_L62P_0) U2.P123(B0:IO_L37N_GCLK12_0) U2.P124(B0:IO_L37P_GCLK13_0) U2.P126(B0:IO_L36N_GCLK14_0) U2.P127(B0:IO_L36P_GCLK15_0) U2.P131(B0:IO_L35N_GCLK16_0) U2.P132(B0:IO_L35P_GCLK17_0) U2.P133(B0:IO_L34N_GCLK18_0) U2.P134(B0:IO_L34P_GCLK19_0) U2.P137(B0:IO_L4N_0) U2.P138(B0:IO_L4P_0) U2.P139(B0:IO_L3N_0) U2.P140(B0:IO_L3P_0) U2.P141(B0:IO_L2N_0) U2.P142(B0:IO_L2P_0) U2.P143(B0:IO_L1N_VREF_0) U3.1(NC_4) U3.7(SYNC_IN+) U3.8(SYNC_IN-) U3.9(SYNC_OUT+) U3.10(SYNC_OUT-) U3.12(SYNC_SMP_ERR) U3.20(CCI_OVFL) U3.24(NC) U3.55(SYNC_CLK) U3.60(OSK) U3.61(NC_2) U3.72(NC_11) U3.86(NC_5) U3.87(NC_6) U3.93(NC_7) U3.94(REFCLK_OUT) U3.97(NC_8) U3.98(NC_3) U3.99(NC_9) U3.100(NC_10) U11.10(10_RESET)

## Buses
LCD_D[3..7],LCD_D[10..12],LCD_HSYNC,LCD_VSYNC,LCD_CLK,LCD_DE,LCD_PWR_EN,LCD_BL_EN,LCD_PWM
SDC1_CLK,SDC1_CMD,SDC1_D[0..3]

## Notes on the sheet
- TODO: REPLACE by DCDC
- VCTCXO optional
- For SFN usage
- OPTIONAL
- For non-SFN usage
- use 4R7 resistor
- Ublox NEO-M8N
- MINI-360 MODULE | MINI-360 MODULE
- Ra
- Rb
- Vout=0.6*(1+Ra/Rb)
- 1.2V DC-DC
- 3.3V DC-DC | 1.8V DC-DC
- OPTIONAL GPS Receiver (for SFN)
- OPTIONAL GPS Receiver (for SFN)
        With embedded GPSDO

## Power pins joined to a net without a drawn wire
GND: FLT1.1(GND) FLT1.3(GND) FLT1.4(GND) FLT1.5(GND) FLT1.7(GND) FLT1.8(GND)

## Library data of the parts
30M72_UFL ANT1 ANT2 = Seeed-OPL-Connector:ANTENNA-CONN-U-FL(3P): 320110048
C1 C2 C6 C23 C30 C38-C40 C50 C52 C53 C55 C56 C88-C90 C105 C211 C232-C237 C239-C241 = Seeed-OPL-Capacitor:CERAMIC-100NF-50V-10%-X7R(0603): 302010138; MPN: CC0603KRX7R9BB104
C3 C60 C63 C64 C66 C67 C69 C71 C72 C74 C75 C78 C79 = cap-master:CNP-: NON-POLARIZED CAP
C4 C7 C91 C92 C94 C98 C100-C102 C104 C108 C110 C113 = Seeed-OPL-Capacitor:CERAMIC-100NF-50V-10%-X7R(0603): 302010138; MPN: CC0603KRX7R9BB104; VALUE: 100nf
C5 C97 C238 C242 = Seeed-Capacitor:CERAMIC-10UF-6.3V-20%-X5R(0603): 302010286; MPN: CC0603MRX5R5BB106
C8 C16 C80 C82 C83 C86 = Seeed-Capacitor:CERAMIC-2.2UF-10V-10%-X7R(0603): 302010054; MPN: CC0603KRX7R6BB225
C9 C10 C12 = Seeed-Capacitor:CERAMIC-10UF-10V-10%-X5R(0603): 302010103; MPN: CC0603KRX5R6BB106
C11 = Seeed-Capacitor:CERAMIC-22PF-50V-5%-NPO(0603): 302010143; MPN: CC0603JRNPO9BN220
C13 C18-C22 C27-C29 C33 C34 C41 C48 C49 C51 C54 C57 = Seeed-Capacitor:CERAMIC-100NF-50V-10%-X7R(0805): 302010165; MPN: CC0805KRX7R9BB104
C14 C15 C58 C81 C84 C85 C99 = Seeed-Capacitor:CERAMIC-1UF-25V-10%-X7R(0603): 302010139; MPN: CC0603KRX7R8BB105
C17 = Seeed-Capacitor:CERAMIC-1NF-50V-10%-X7R(0603): 302010141; MPN: CC0603KRX7R9BB102
C24-C26 C35-C37 C59 C87 C112 = Seeed-Capacitor:TANTALUM-SMD-10UF-10V-10%(AVX-A): 302020011; MPN: TAJA106K010RNJ
C31 C42-C46 = rcl:C-EU: CAPACITOR, European symbol
C32 = rcl:CPOL-EU: POLARIZED CAPACITOR, European symbol
C47 = Seeed-Capacitor:CERAMIC-10UF-25V-10%-X5R(0805): 302010178; MPN: CC0805KKX5R8BB106
C61 C62 C114 = Seeed-Capacitor:CERAMIC-27PF-50V-5%-NPO(0603): 302010142; MPN: CC0603JRNPO9BN270
C65 C68 C70 C73 = resistor:C-EU: CAPACITOR, European symbol
C76 = Seeed-OPL-Capacitor:TANTALUM-SMD-470UF-6.3V(AVX-D): 302020027; VALUE: 470uf
C77 = Seeed-OPL-Capacitor:TANTALUM-SMD-10UF-10V-10%(AVX-A): 302020011; MPN: TAJA106K010RNJ
C93 C103 = Seeed-OPL-Capacitor:CERAMIC-10UF-6.3V-20%-X5R(0603): 302010286; MPN: CC0603MRX5R5BB106
C95 C106 = Seeed-OPL-Capacitor:CERAMIC-10UF-6.3V-20%-X5R(0603): 302010286; MPN: CC0603MRX5R5BB106; VALUE: 10UF 6.3V
C96 = Seeed-Capacitor:CERAMIC-4.7UF-10V-10%-X5R(0603): 302010111; MPN: CC0603KRX5R6BB475
C107 = Seeed-OPL-Capacitor:CERAMIC-4.7UF-50V-10%-X5R(1206): 302010243; MPN: CC1206KKX5R9BB475; VALUE: 4.7uf
C109 = Seeed-Capacitor:CERAMIC-10UF-10V-(-20%～+80%)-Y5V(0805): 302010158; MPN: CC0805ZKY5V6BB106
C111 = Seeed-Capacitor:TANTALUM-SMD-10UF-16V-10%(AVX-A): 302020002; MPN: TAJA106K016RNJ
D1 = Seeed-OPL-Diode:SMD-DIODE-ESD-6.2V-250MW(SOD-123): 304060001; MPN: CESD5V0D1; VALUE: CESD5V0D1
D22-D24 = Seeed-OPL-Diode:SMD-DIODE-ESD-6.2V-250MW(SOD-123): 304060001; MPN: CESD5V0D1
FET1 = Penko:P-MOS+DIOD
FLT1 = minicircuits_filter:RBP: Voltage variale attenuator Features: Broadband, 10-2500 MHz IP3, +43dBm typical 40 dB attenuation @ 1500 MHz good VSWR at IN/OUT ports over attenuation range minimal phase deviation over attenuation range no external bias and RF matching network required shieled case Maximum ratings: Operating temperature -55°C to +85°C Storage Temperature -55°C to +85°C Absolute Max. power supply voltage (PWR pin): 12V Absolute Max. control voltage (CTRL pin): 20V Absolute Max. RF input level: 100 mW Opetaring conditions: CRTL: 0-17V, 30 mA max minimum insertion loss at maximum voltage ctrl PRW: +3V to +5V, 5 mA max
IC1 = allwinner_v3s:ALLWINNER_V3S: pin_pads2 edit this description Auto generated by make-symbol-device-package-bsdl.ulp Rev. 44 Source: pin_pads2.txt
IC2 = V3s_LX9_AD9957_gps:XC63FP: Positiv Voltage Regulators www.torex.co.jp/english/product/pro02/pdf/0201_xc62fp.pdf
IC5 IC12 = v-reg:LD117A?*: Low drop fixed and adjustable positive voltage regulators 1 A Source: http://www.st.com/stonline/products/literature/ds/7194/ld1117axx.pdf
IC10 IC11 = mp2307:MP2307: MP2307 DC-DC
J1 = Seeed-OPL-Connector:SMD-FPC-CONN(40P-0.5): 320060006; MPN: 5922-4P-60P-0HD1R
J2 = con-jack:JACK-PLUG: DC POWER JACK Power Jack, DC, Right Angle, Through Hole, Rated 5A at 16VDC, PC Terminals Distributor: Farnell (www.Farnell.de) Drawing: 84N1161.pdf / 84N1162.pdf Manufacturer: SPC Technology (www.spctechnology.com) Type: SPC4077 / SPC 4078; OC_FARNELL: unknown; OC_NEWARK: unknown
JMP1 = jump-0r-smd:0R-JUMP: SMD 0R 0805 Jumper
L1 L2 L5 L6 L10 = ipc-7351-inductor:INDUCTOR_
L3 = rcl:L-EU: INDUCTOR, European symbol
L4 L9 = OLIMEX_DISCRET:L
L7 L8 = inductors:DR74: High Power Density, High Efficiency, Shielded Inductors Source: coiltronics_dr_series.pdf
LED1 LED3 = Seeed-OPL-Diode:DIP-LED-GREEN-GREEN(2P-D3MM): 304090040; MPN: CX-G302DC
LED2 = adafruit:LED: LED OSRAM: - CHIPLED LG R971, LG N971, LY N971, LG Q971, LY Q971, LO R971, LY R971 LH N974, LH R974 LS Q976, LO Q976, LY Q976 LO Q996 - Hyper CHIPLED LW Q18S LB Q993, LB Q99A, LB R99A - SideLED LS A670, LO A670, LY A670, LG A670, LP A670 LB A673, LV A673, LT A673, LW A673 LH A674 LY A675 LS A676, LA A676, LO A676, LY A676, LW A676 LS A679, LY A679, LG A679 - Hyper Micro SIDELED® LS Y876, LA Y876, LO Y876, LY Y876 LT Y87S - SmartLED LW L88C, LW L88S LB L89C, LB L89S, LG L890 LS L89K, LO L89K, LY L89K LS L896, LA L896, LO L896, LY L896 - TOPLED LS T670, LO T670, LY T670, LG T670, LP T670 LSG T670, LSP T670, LSY T670, LOP T670, LYG T670 LG T671, LOG T671, LSG T671 LB T673, LV T673, LT T673, LW T673 LH T674 LS T676, LA T676, LO T676, LY T676, LB T676, LH T676, LSB T676, LW T676 LB T67C, LV T67C, LT T67C, LS T67K, LO T67K, LY T67K, LW E67C LS E67B, LA E67B, LO E67B, LY E67B, LB E67C, LV E67C, LT E67C LW T67C LS T679, LY T679, LG T679 LS T770, LO T770, LY T770, LG T770, LP T770 LB T773, LV T773, LT T773, LW T773 LH T774 LS E675, LA E675, LY E675, LS T675 LS T776, LA T776, LO T776, LY T776, LB T776 LHGB T686 LT T68C, LB T68C - Hyper Mini TOPLED® LB M676 - Mini TOPLED Santana® LG M470 LS M47K, LO M47K, LY M47K Source: http://www.osram.convergy.de/
LED4 = Seeed-OPL-Diode:DIP-LED-YELLOW-YELLOW-Y304DC(2P-D3MM): 304090085; MPN: Y304DC; VALUE: Y304DC
P1-P8 = wirepad:1,6/0,8: THROUGH-HOLE PAD
P9 P10 = A13-OLinuXino_WIFI_Rev_G:TESTPAD: drill 40mils, diameter 70mils
PH2 PH3 = V3s_LX9_AD9957_gps:PH1X4
Q1 = crystal:HC49/S: CRYSTAL
Q2 Q3 = adafruit:XTAL-4: Classic 4-pin 3.2 x 2.5mm crystal
R1 R3 R12 R13 R15-R19 R21 R22* R36-R38 R41 = rcl:R-EU_: RESISTOR, European symbol
R2 R4-R11 R14 R20 R22 R35 R42-R56 R92 R99 R111 R112 R116 = Seeed-OPL-Resistor:SMD-RES-6.8K-1%-1/10W(0603): 301010198; MPN: RC0805JR-07220KL; VALUE: 6.8K
R23 = Seeed-Resistor-2016:SMD-RES-49.9R-1%-1/16W(0402): 301010041; MPN: RC0402FR-0749R9L; VALUE: 49.9R
R24-R34 R39 R40 = resistor:R-EU_: RESISTOR, European symbol
RJ1 = W5500_LX9_AD9957:HR911105A
RM1 RM2 = V3s_LX9_AD9957_gps:R_MATRIX_4E
S1 = minicircuits_filter:31-XX: OMRON SWITCH Now with beefier pads!
SD/MMC1 = A13-OLinuXino_WIFI_Rev_G:MICRO_SD/MMC_CP_NEW
SV1 = con-lstb:MA06-1: PIN HEADER; OC_FARNELL: unknown; OC_NEWARK: unknown
T1 = mini-circuits:TC1-1TG2+: RF TRANSFORMER
U1 = ad9864:N25Q256A13EF840E; COPYRIGHT: Copyright C 2015 Accelerated Designs. All rights reserved; MANUFACTURER_PART_NUMBER: n25q256a13ef840e; VENDOR: MICRON
U2 = xilinx_devices_V6:6SLX9TQG144: Xilinx FPGA: 6SLX9TQG144
U3 = ad9957:AD9957BSVZ: TQFP-100,1 GSPS Quadrature Digital Upconverter; MPN: AD9957BSVZ; OC_FARNELL: 1438898; OC_NEWARK: 50M0846; PACKAGE: TQFP-100; SUPPLIER: Analog Devices
U4 = OLIMEX_IC:SY8008
U5 = V3s_LX9_AD9957_gps:LT3060EDC-1.8TRMPBF; MANUFACTURER_PART_NUMBER: LT3060EDC1.8#TRMPBF; VENDOR: Linear Technology
U6 = sy7201:SY7201: Simple Power Sequencer Precision enable pin & 3 open-drain output flags Input Voltage Range of 2.7 V to 5.5 V Power-Up and Power-Down Control LM3880MF-1XY (Timing Designator) AF 16ms AE 2ms AA 10ms AB 30ms AC 60ms AD 120ms The timing sequence of the LM3880 is controlled entirely by the enable (EN) pin. Upon power up, all the flags are held low until this precision enable is pulled high; PROD_ID: PROTOTYPE; VALUE: LM3880
U10 = ubloxLib:NEO-M8: u-blox NEO GNSS module
U11 = V3s_LX9_AD9957_gps:UBLOX_LEA-6
USB2 = Seeed-OPL-Connector:MICRO-USB-SMD-B-(10118193-0001LF): 320010003; MPN: 10118193-0001LF
X1 = adafruit:SMACONNECTOR: SMA Connector 90° DIP SMA Connector, 50 Ohm (4UConnector: 07259)
X3 = gps_sfn_conn:W5500_LX9_AD9957_SMACONNECTOR: SMA Connector 90° DIP SMA Connector, 50 Ohm (4UConnector: 07259)
X4 = Seeed-OPL-crystal-osctllator:SMD-CRYSTAL-16MHZ-9PF-10PPM-60R(4P-3.2X2.5MM): 306010078; VALUE: 16MHZ